# Altium schematic sheet eMMC FLASH.SchDoc: eMMC
size A3; DrawnBy: UKAYACIK; Engineer: UKAYACIK; DocumentNumber: 11; Revision: A; SheetNumber: 13; SheetTotal: 21
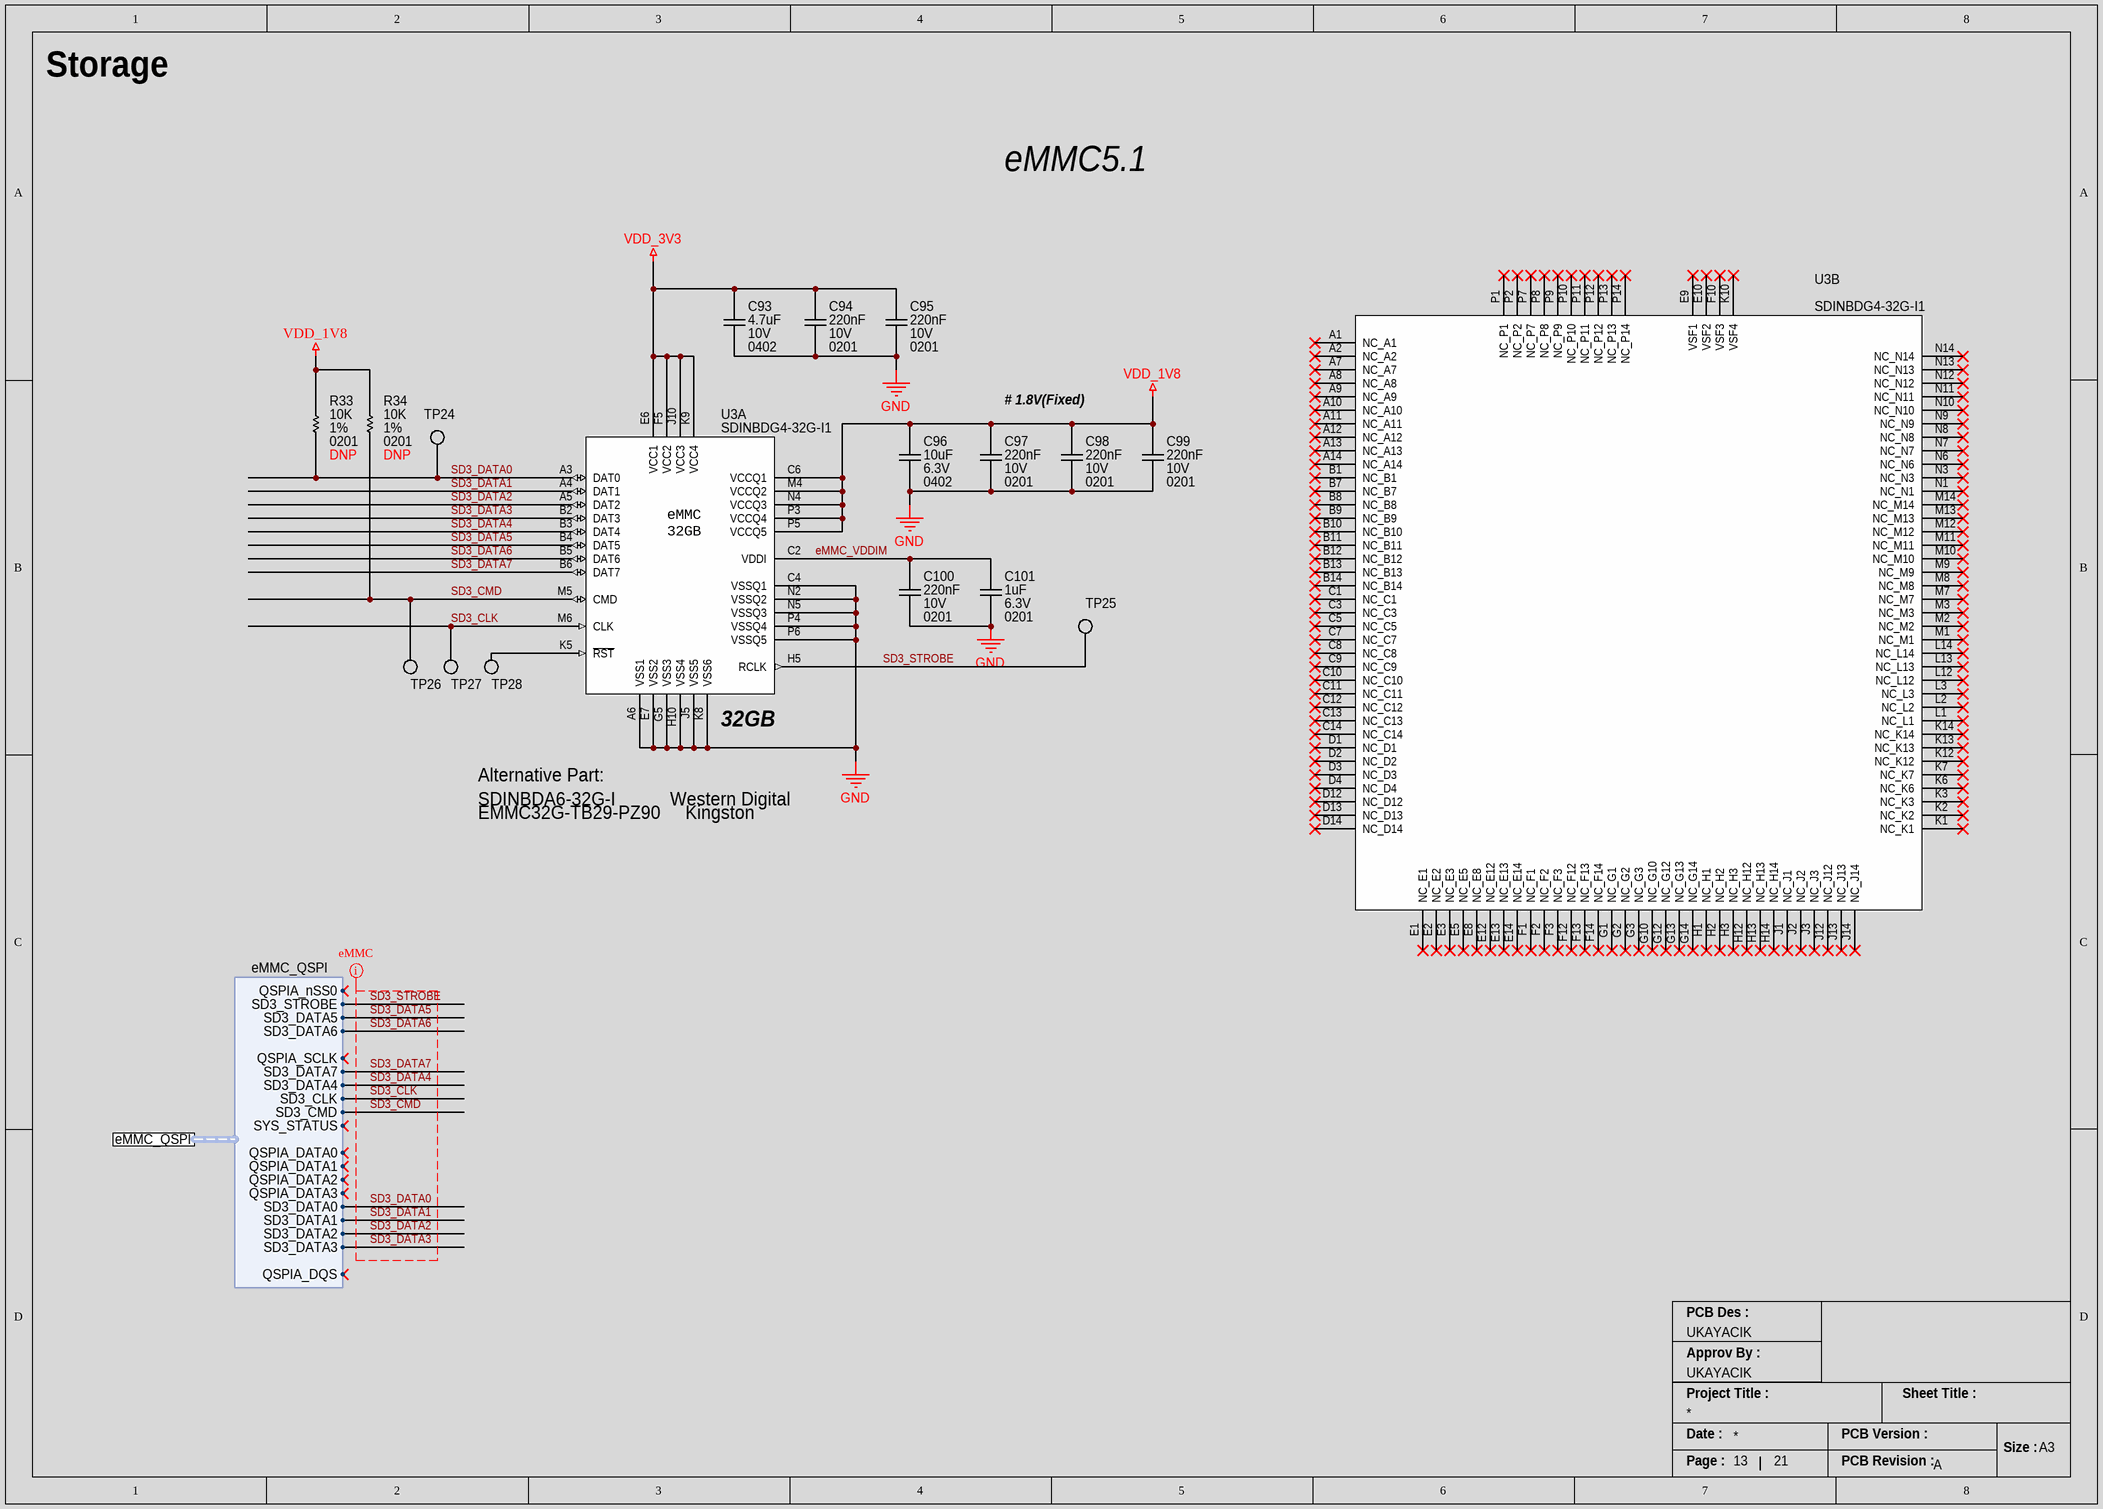
[diagram p0: eMMC FLASH.SchDoc]

## Parts
C93  Capacitance: 4.7uF  Voltage Rating: 10V  Case/Package: 0402  [CAP_0402_CAPC1005X05N]  (hidden comment: CL05A475KP5NRNC)
C94  Voltage Rating (DC): 10V  Capacitance: 220nF  Case/Package: 0201  [CAP_0201_CAPC0603X03N]  (hidden comment: LMK063BJ224MP-F)
C95  Voltage Rating (DC): 10V  Capacitance: 220nF  Case/Package: 0201  [CAP_0201_CAPC0603X03N]  (hidden comment: LMK063BJ224MP-F)
C96  Case/Package: 0402  Capacitance: 10uF  Voltage Rating: 6.3V  [CAP_0402_CAPC1005X05N]  (hidden comment: CL05A106MQ5NUNC)
C97  Voltage Rating (DC): 10V  Capacitance: 220nF  Case/Package: 0201  [CAP_0201_CAPC0603X03N]  (hidden comment: LMK063BJ224MP-F)
C98  Voltage Rating (DC): 10V  Capacitance: 220nF  Case/Package: 0201  [CAP_0201_CAPC0603X03N]  (hidden comment: LMK063BJ224MP-F)
C99  Voltage Rating (DC): 10V  Capacitance: 220nF  Case/Package: 0201  [CAP_0201_CAPC0603X03N]  (hidden comment: LMK063BJ224MP-F)
C100  Voltage Rating (DC): 10V  Capacitance: 220nF  Case/Package: 0201  [CAP_0201_CAPC0603X03N]  (hidden comment: LMK063BJ224MP-F)
C101  Voltage Rating (DC): 6.3V  Capacitance: 1uF  Case/Package: 0201  [CAP_0201_CAPC0603X03N]  (hidden comment: 02016D105MAT2A)
R33  Tolerance: 1%  Resistance: 10K  Case Code (Imperial): 0201  [RES_0201_RESC0603X02N]  (hidden comment: RC0201FR-0710KL)
R34  Tolerance: 1%  Resistance: 10K  Case Code (Imperial): 0201  [RES_0201_RESC0603X02N]  (hidden comment: RC0201FR-0710KL)
TP24  NO COMPONENT  [TP_PAD_0.5MM_SMD_ROUND]  (value not drawn)  (no BOM)
TP25  NO COMPONENT  [TP_PAD_0.5MM_SMD_ROUND]  (value not drawn)  (no BOM)
TP26  NO COMPONENT  [TP_PAD_0.5MM_SMD_ROUND]  (value not drawn)  (no BOM)
TP27  NO COMPONENT  [TP_PAD_0.5MM_SMD_ROUND]  (value not drawn)  (no BOM)
TP28  NO COMPONENT  [TP_PAD_0.5MM_SMD_ROUND]  (value not drawn)  (no BOM)
U3  SDINBDG4-32G-I1  [IC_MEMORY_eMMC]  (parts A,B of 2)

## Ports
eMMC_QSPI (harness eMMC_QSPI)

## Harnesses
eMMC_QSPI: SD3_STROBE, SD3_DATA5, SD3_DATA6, SD3_DATA7, SD3_DATA4, SD3_CLK, SD3_CMD, SYS_STATUS, QSPIA_DATA0, QSPIA_DATA1, QSPIA_DATA2, QSPIA_DATA3, QSPIA_nSS0, SD3_DATA0, QSPIA_SCLK, SD3_DATA1, SD3_DATA2, SD3_DATA3, QSPIA_DQS

## Nets
GND: C93.1 C94.1 C95.1 C96.1 C97.1 C98.1 C99.1 C100.1 C101.1 U3.A6(VSS1) U3.C4(VSSQ1) U3.E7(VSS2) U3.G5(VSS3) U3.H10(VSS4) U3.J5(VSS5) U3.K8(VSS6) U3.N2(VSSQ2) U3.N5(VSSQ3) U3.P4(VSSQ4) U3.P6(VSSQ5)
VDD_1V8: C96.2 C97.2 C98.2 C99.2 R33.2 R34.2 U3.C6(VCCQ1) U3.M4(VCCQ2) U3.N4(VCCQ3) U3.P3(VCCQ4) U3.P5(VCCQ5)
VDD_3V3: C93.2 C94.2 C95.2 U3.E6(VCC1) U3.F5(VCC2) U3.J10(VCC3) U3.K9(VCC4)
eMMC_VDDIM: C100.2 C101.2 U3.C2(VDDI)
SD3_CLK: TP27.1 U3.M6(CLK) ; port eMMC_QSPI.SD3_CLK
SD3_CMD: R34.1 TP26.1 U3.M5(CMD) ; port eMMC_QSPI.SD3_CMD
SD3_DATA0: R33.1 TP24.1 U3.A3(DAT0) ; port eMMC_QSPI.SD3_DATA0
SD3_DATA1: U3.A4(DAT1) ; port eMMC_QSPI.SD3_DATA1
SD3_DATA2: U3.A5(DAT2) ; port eMMC_QSPI.SD3_DATA2
SD3_DATA3: U3.B2(DAT3) ; port eMMC_QSPI.SD3_DATA3
SD3_DATA4: U3.B3(DAT4) ; port eMMC_QSPI.SD3_DATA4
SD3_DATA5: U3.B4(DAT5) ; port eMMC_QSPI.SD3_DATA5
SD3_DATA6: U3.B5(DAT6) ; port eMMC_QSPI.SD3_DATA6
SD3_DATA7: U3.B6(DAT7) ; port eMMC_QSPI.SD3_DATA7
SD3_STROBE: TP25.1 U3.H5(RCLK) ; port eMMC_QSPI.SD3_STROBE
NetTP28_1: TP28.1 U3.K5(~{RST})

Not connected (* = marked no-connect by the designer): U3 A1(NC_A1)* A2(NC_A2)* A7(NC_A7)* A8(NC_A8)* A9(NC_A9)* A10(NC_A10)* A11(NC_A11)* A12(NC_A12)* A13(NC_A13)* A14(NC_A14)* B1(NC_B1)* B7(NC_B7)* B8(NC_B8)* B9(NC_B9)* B10(NC_B10)* B11(NC_B11)* B12(NC_B12)* B13(NC_B13)* B14(NC_B14)* C1(NC_C1)* C3(NC_C3)* C5(NC_C5)* C7(NC_C7)* C8(NC_C8)* C9(NC_C9)* C10(NC_C10)* C11(NC_C11)* C12(NC_C12)* C13(NC_C13)* C14(NC_C14)* D1(NC_D1)* D2(NC_D2)* D3(NC_D3)* D4(NC_D4)* D12(NC_D12)* D13(NC_D13)* D14(NC_D14)* E1(NC_E1)* E2(NC_E2)* E3(NC_E3)* E5(NC_E5)* E8(NC_E8)* E9(VSF1)* E10(VSF2)* E12(NC_E12)* E13(NC_E13)* E14(NC_E14)* F1(NC_F1)* F2(NC_F2)* F3(NC_F3)* F10(VSF3)* F12(NC_F12)* F13(NC_F13)* F14(NC_F14)* G1(NC_G1)* G2(NC_G2)* G3(NC_G3)* G10(NC_G10)* G12(NC_G12)* G13(NC_G13)* G14(NC_G14)* H1(NC_H1)* H2(NC_H2)* H3(NC_H3)* H12(NC_H12)* H13(NC_H13)* H14(NC_H14)* J1(NC_J1)* J2(NC_J2)* J3(NC_J3)* J12(NC_J12)* J13(NC_J13)* J14(NC_J14)* K1(NC_K1)* K2(NC_K2)* K3(NC_K3)* K6(NC_K6)* K7(NC_K7)* K10(VSF4)* K12(NC_K12)* K13(NC_K13)* K14(NC_K14)* L1(NC_L1)* L2(NC_L2)* L3(NC_L3)* L12(NC_L12)* L13(NC_L13)* L14(NC_L14)* M1(NC_M1)* M2(NC_M2)* M3(NC_M3)* M7(NC_M7)* M8(NC_M8)* M9(NC_M9)* M10(NC_M10)* M11(NC_M11)* M12(NC_M12)* M13(NC_M13)* M14(NC_M14)* N1(NC_N1)* N3(NC_N3)* N6(NC_N6)* N7(NC_N7)* N8(NC_N8)* N9(NC_N9)* N10(NC_N10)* N11(NC_N11)* N12(NC_N12)* N13(NC_N13)* N14(NC_N14)* P1(NC_P1)* P2(NC_P2)* P7(NC_P7)* P8(NC_P8)* P9(NC_P9)* P10(NC_P10)* P11(NC_P11)* P12(NC_P12)* P13(NC_P13)* P14(NC_P14)*

## Layout directives
net class eMMC: SD3_CLK, SD3_CMD, SD3_DATA0, SD3_DATA1, SD3_DATA2, SD3_DATA3, SD3_DATA4, SD3_DATA5, SD3_DATA6, SD3_DATA7, SD3_STROBE

## Notes on the sheet
- Storage
- eMMC5.1
- # 1.8V(Fixed)
- DNP
- (near R34) DNP
- Alternative Part:
- (near U3) 32GB
- SDINBDA6-32G-I           Western Digital
- EMMC32G-TB29-PZ90     Kingston
- PCB Des :
- Approv By :
- Project Title :
- Sheet Title :
- Date :
- PCB Version :
- Size :
- A3
- Page :
- PCB Revision :
- (in symbol IC_MEMORY_eMMC_SDINBDG4-32G-I1, part A) eMMC / 32GB

## Library data of the parts
C93 = CAP_4.7UF_10V_X5R_0402: Multilayer Ceramic Capacitor, 4.7 uF, 10 V, ± 10%, X5R, 0402 [1005 Metric]; Manufacturer: Samsung; Supplier 1: Digikey; Manufacturer Part Number: CL05A475KP5NRNC; RoHS: Yes; Category: Ceramic Capacitors; Stock 1: 748042; Pricing 1: 1=0.28, 10=0.184, 50=0.129, 100=0.1042, 500=0.0774, 1000=0.06772, 2500=0.0645, 5000=0.05966 (USD); Mount: Surface Mount; Case Code (Metric): 1005; Case Code (Imperial): 0402; Material: Ceramic; Min Operating Temperature: -55°C; Max Operating Temperature: 85°C; Tolerance: 10%; Packaging: Tape and Reel; Package Quantity: 1; Dielectric: X5R; Series: CL; Construction: Flat; Length: 1mm; Width: 0.02inch; Height: 0.5mm; Thickness: 0.022inch; Depth: 0.5mm; Radiation Hardening: No; RoHS Compliant: Yes; Lead Free: Lead Free; ComponentLink1URL: https://datasheet.ciiva.com/25724/cl05a475kp5nrnc-25724404.pdf?src-supplier=Digikey; ComponentLink1Description: https://datasheet.ciiva.com/25724/cl05a475kp5nrnc-25724404.pdf?src-supplier=Digikey; ComponentLink2URL: https://datasheet.ciiva.com/29198/458873-da-01-en-vs-kondensator-0402-29198304.pdf?src-supplier=Conrad; ComponentLink2Description: https://datasheet.ciiva.com/29198/458873-da-01-en-vs-kondensator-0402-29198304.pdf?src-supplier=Conrad; Supplier Part Number 1: 1276-1480-1-ND
C94 C95 C97-C100 = CAP_0.22UF_10V_X5R_0201: Multilayer Ceramic Capacitors (High dielectric type), 10V, 0.22 uF, ± 20 %, 0201, X5R, RoHS; Manufacturer: Taiyo Yuden; Material: 4241ConductorMaterial; Tolerance: 20%; Supplier 1: Digikey; Manufacturer Part Number: LMK063BJ224MP-F; RoHS: Yes; Category: Ceramic Capacitors; Stock 1: 6053224; Pricing 1: 1=0.12, 10=0.08, 50=0.0478, 100=0.0375, 500=0.02772, 1000=0.02295, 2500=0.02136, 5000=0.01954 (USD); Mount: Surface Mount; Case Code (Metric): 0603; Case Code (Imperial): 0201; Min Operating Temperature: -55°C; Max Operating Temperature: 85°C; Voltage Rating: 10V; Packaging: Tape and Reel; Package Quantity: 15000; Dielectric: X5R; Termination: SMD/SMT; Voltage: 10V; Series: M; Construction: Flat; Length: 0.6mm; Width: 0.3mm; Height: 0.3mm; Depth: 0.3mm; Radiation Hardening: No; Halogen Free: Halogen Free; RoHS Compliant: Yes; Reach SVHC Compliant: Unknown; ComponentLink1URL: https://datasheet.ciiva.com/134/lmk063bj224mp-f-ss-134995.pdf?src-supplier=Digikey; ComponentLink1Description: https://datasheet.ciiva.com/134/lmk063bj224mp-f-ss-134995.pdf?src-supplier=Digikey; ComponentLink2URL: https://datasheet.ciiva.com/11464/lmk063bj224mp-f-ss-11464053.pdf?src-supplier=Avnet; ComponentLink2Description: https://datasheet.ciiva.com/11464/lmk063bj224mp-f-ss-11464053.pdf?src-supplier=Avnet; ComponentLink3URL: https://datasheet.ciiva.com/15921/1589lmk063bj224mp-f-15921250.pdf?src-supplier=Onlinecomponents.com; ComponentLink3Description: https://datasheet.ciiva.com/15921/1589lmk063bj224mp-f-15921250.pdf?src-supplier=Onlinecomponents.com; ComponentLink4URL: https://datasheet.ciiva.com/26872/getdatasheetpartid-639019-26872592.pdf?src-supplier=Verical; ComponentLink4Description: https://datasheet.ciiva.com/26872/getdatasheetpartid-639019-26872592.pdf?src-supplier=Verical; ComponentLink5URL: https://datasheet.ciiva.com/30243/100lmk063bj224mp-f-30243150.pdf?src-supplier=Onlinecomponents.com; ComponentLink5Description: https://datasheet.ciiva.com/30243/100lmk063bj224mp-f-30243150.pdf?src-supplier=Onlinecomponents.com; ComponentLink6URL: https://datasheet.ciiva.com/28645/746258-28645141.pdf?src-supplier=Element14; ComponentLink6Description: https://datasheet.ciiva.com/28645/746258-28645141.pdf?src-supplier=Element14; ComponentLink7URL: https://datasheet.ciiva.com/5422/mlcc-all-e-541559-5422365.pdf?src-supplier=Mouser; ComponentLink7Description: https://datasheet.ciiva.com/5422/mlcc-all-e-541559-5422365.pdf?src-supplier=Mouser; Supplier Part Number 1: 587-2483-1-ND
C96 = CAP_10UF_6.3V_X5R_0402: Cap Ceramic 10uF 6.3V X5R 20% SMD 0402 85C T/R; Manufacturer: Samsung; Supplier 1: Digikey; Manufacturer Part Number: CL05A106MQ5NUNC; RoHS: Yes; Category: Ceramic Capacitors; Stock 1: 6097180; Pricing 1: 1=0.24, 10=0.153, 50=0.0968, 100=0.0774, 500=0.05588, 1000=0.04943, 2500=0.04728, 5000=0.04299 (USD); Mount: Surface Mount; Case Code (Metric): 1005; Case Code (Imperial): 0402; Min Operating Temperature: -55°C; Max Operating Temperature: 85°C; Packaging: Tape and Reel; Tolerance: 20%; Dielectric: X5R; Series: CL; Package Quantity: 1; Construction: Flat; Length: 1mm; Width: 0.02inch; Height: 0.5mm; Depth: 0.5mm; Thickness: 0.028inch; Radiation Hardening: No; RoHS Compliant: Yes; ComponentLink1URL: https://datasheet.ciiva.com/16437/cl05a106mq5nunc-16437356.pdf?src-supplier=Future+Electronics; ComponentLink1Description: https://datasheet.ciiva.com/16437/cl05a106mq5nunc-16437356.pdf?src-supplier=Future+Electronics; ComponentLink2URL: https://datasheet.ciiva.com/26877/getdatasheetpartid-355289-26877841.pdf?src-supplier=Verical; ComponentLink2Description: https://datasheet.ciiva.com/26877/getdatasheetpartid-355289-26877841.pdf?src-supplier=Verical; Supplier Part Number 1: 1276-1451-1-ND
C101 = CAP_1UF_6.3V_X5R_0201: 0201 1 uF 6.3 V ±20 % Tolerance X5R Surface Mount Multilayer Ceramic Capacitor; Manufacturer: Kyocera AVX; Tolerance: 20%; Supplier 1: Mouser; Manufacturer Part Number: 02016D105MAT2A; RoHS: Yes; Category: Ceramic Capacitors; Stock 1: 1026413; Pricing 1: 1=0.1, 10=0.028, 50=0.028, 100=0.014, 1000=0.008, 10000=0.006 (USD); Mount: Surface Mount; Number of Pins: 2; Case Code (Metric): 0603; Case Code (Imperial): 0201; Min Operating Temperature: -55°C; Max Operating Temperature: 85°C; Packaging: Cut Tape; Series: -; Voltage Rating: 6.3V; Package Quantity: 1; Length: 0.024inch; Width: 0.012inch; Thickness: 0.013inch; Depth: 0.3mm; Lead Free: Lead Free; RoHS Compliant: Yes; Reach SVHC Compliant: No; ComponentLink1URL: https://datasheet.ciiva.com/6265/cx5r-6265595.pdf?src-supplier=Digi-Key; ComponentLink1Description: https://datasheet.ciiva.com/6265/cx5r-6265595.pdf?src-supplier=Digi-Key; ComponentLink2URL: https://datasheet.ciiva.com/1123/1666675-1123122.pdf?src-supplier=Element14; ComponentLink2Description: https://datasheet.ciiva.com/1123/1666675-1123122.pdf?src-supplier=Element14; ComponentLink3URL: https://datasheet.ciiva.com/14891/cx5r-14891029.pdf?src-supplier=Digi-Key; ComponentLink3Description: https://datasheet.ciiva.com/14891/cx5r-14891029.pdf?src-supplier=Digi-Key; ComponentLink4URL: https://datasheet.ciiva.com/7614/cx5r-7614682.pdf?src-supplier=Digi-Key; ComponentLink4Description: https://datasheet.ciiva.com/7614/cx5r-7614682.pdf?src-supplier=Digi-Key; ComponentLink5URL: https://datasheet.ciiva.com/14891/cx5r-14891030.pdf?src-supplier=Digi-Key; ComponentLink5Description: https://datasheet.ciiva.com/14891/cx5r-14891030.pdf?src-supplier=Digi-Key; Supplier Part Number 1: 581-02016D105MAT2A; Dielectric: X5R
R33 R34 = RES_10K_1/12W_1%_0201: SMD Chip Resistor, 10 kOhm, ± 1%, 50 mW, 0201 [0603 Metric], Thick Film, General Purpose; Manufacturer: Yageo; Temperature Coefficient: 200ppm/°C; Power Rating: 50mW; Voltage Rating: 25V; Supplier 1: Digikey; Manufacturer Part Number: RC0201FR-0710KL; RoHS: Yes; Category: Chip SMD Resistors; Stock 1: 12030325; Pricing 1: 1=0.1, 10=0.027, 50=0.0172, 100=0.0143, 500=0.00988, 1000=0.00854, 5000=0.00629 (USD); Case/Package: 0201; Number of Pins: 2NUMBER; Contact Plating: Tin,Matte; Case Code (Metric): 0603; Weight: 6E-06oz; Min Operating Temperature: -55°C; Max Operating Temperature: 125°C; Packaging: Tape and Reel; Package Quantity: 10000; Termination: SMD/SMT; Resistor Type: Thick Film; Series: RC; Number of Terminations: 2; Max Power Dissipation: 50mW; Working Voltage: 25V; Features: Moisture Resistant; Technology: THICK FILM; Resistance Tolerance: 1%; Construction: Rectangular; Voltage Rating (DC): 25V; Length: 0.6mm; Width: 0.012inch; Height: 0.01inch; Depth: 0.3mm; RoHS Compliant: Yes; Reach SVHC Compliant: No; Military Standard: Not; Lead Free: 5697LeadFree; ComponentLink1URL: https://datasheet.ciiva.com/7660/1421516-7660807.pdf?src-supplier=Element14; ComponentLink1Description: https://datasheet.ciiva.com/7660/1421516-7660807.pdf?src-supplier=Element14; ComponentLink2URL: https://datasheet.ciiva.com/46391/1421516-46391339.pdf?src-supplier=Element14; ComponentLink2Description: https://datasheet.ciiva.com/46391/1421516-46391339.pdf?src-supplier=Element14; ComponentLink3URL: https://datasheet.ciiva.com/2467/pyu-r-int-thick-7-2467110.pdf?src-supplier=Digikey; ComponentLink3Description: https://datasheet.ciiva.com/2467/pyu-r-int-thick-7-2467110.pdf?src-supplier=Digikey; ComponentLink4URL: https://datasheet.ciiva.com/2467/pyu-r-int-thick-7-2467111.pdf?src-supplier=Digikey; ComponentLink4Description: https://datasheet.ciiva.com/2467/pyu-r-int-thick-7-2467111.pdf?src-supplier=Digikey; ComponentLink5URL: https://datasheet.ciiva.com/2467/pyu-r-int-thick-7-2467109.pdf?src-supplier=Digikey; ComponentLink5Description: https://datasheet.ciiva.com/2467/pyu-r-int-thick-7-2467109.pdf?src-supplier=Digikey; ComponentLink6URL: https://datasheet.ciiva.com/26829/getdatasheetpartid-421074-26829851.pdf?src-supplier=Verical; ComponentLink6Description: https://datasheet.ciiva.com/26829/getdatasheetpartid-421074-26829851.pdf?src-supplier=Verical; ComponentLink7URL: https://datasheet.ciiva.com/8891/pyu-rc0201-51-rohs-l-8-8891384.pdf?src-supplier=Avnet; ComponentLink7Description: https://datasheet.ciiva.com/8891/pyu-rc0201-51-rohs-l-8-8891384.pdf?src-supplier=Avnet; Supplier Part Number 1: 311-10.0KMCT-ND
TP24-TP28 = TP_PAD_SMD_SMALL: Test Point, SMD pad, round, 1.5mm, 1.6mm, 3mm diameter
U3 = IC_MEMORY_eMMC_SDINBDG4-32G-I1: Inand 7250 32GB Industrial Wide Temp -25C+85C EMMC5.1 HS400; Manufacturer: SanDisk; Supplier 1: Mouser; Manufacturer Part Number: SDINBDG4-32G-I1; RoHS: No; Category: Uncategorized; Stock 1: 1018; Pricing 1: 1=26.46, 10=24.64, 50=23.78, 100=20.87, 1000=20.16, 10000=20.16 (USD); RoHS Compliant: No; Supplier Part Number 1: 467-SDINBDG4-32G-I1